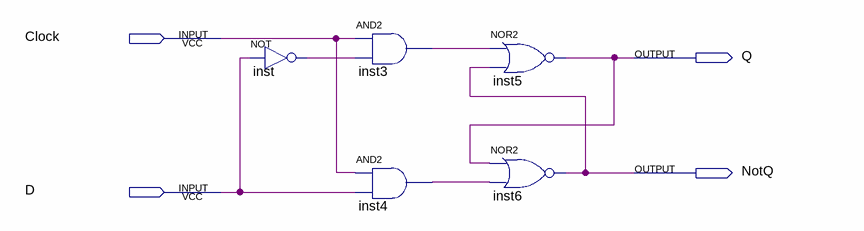
[diagram p0: schematic sheet]
// Quartus schematic assign2_1.bdf as structural Verilog: 5 symbols, 4 pins
module assign2_1 (
  input  Clock,
  input  D,
  output Q,
  output NotQ
);

  wire inst3_out, inst4_out, inst_out;

  not inst (inst_out, D);
  and inst3 (inst3_out, Clock, inst_out);
  and inst4 (inst4_out, Clock, D);
  nor inst5 (Q, inst3_out, NotQ);
  nor inst6 (NotQ, Q, inst4_out);
endmodule
